# EasyEDA schematic SCH_minifinal_2022-12-07.json
TITLE: 2 Digit bcd adder/7 Segment Display; REV: 13.0; Date: 2022-12-01; Sheet: 1/1; Company: Your Company
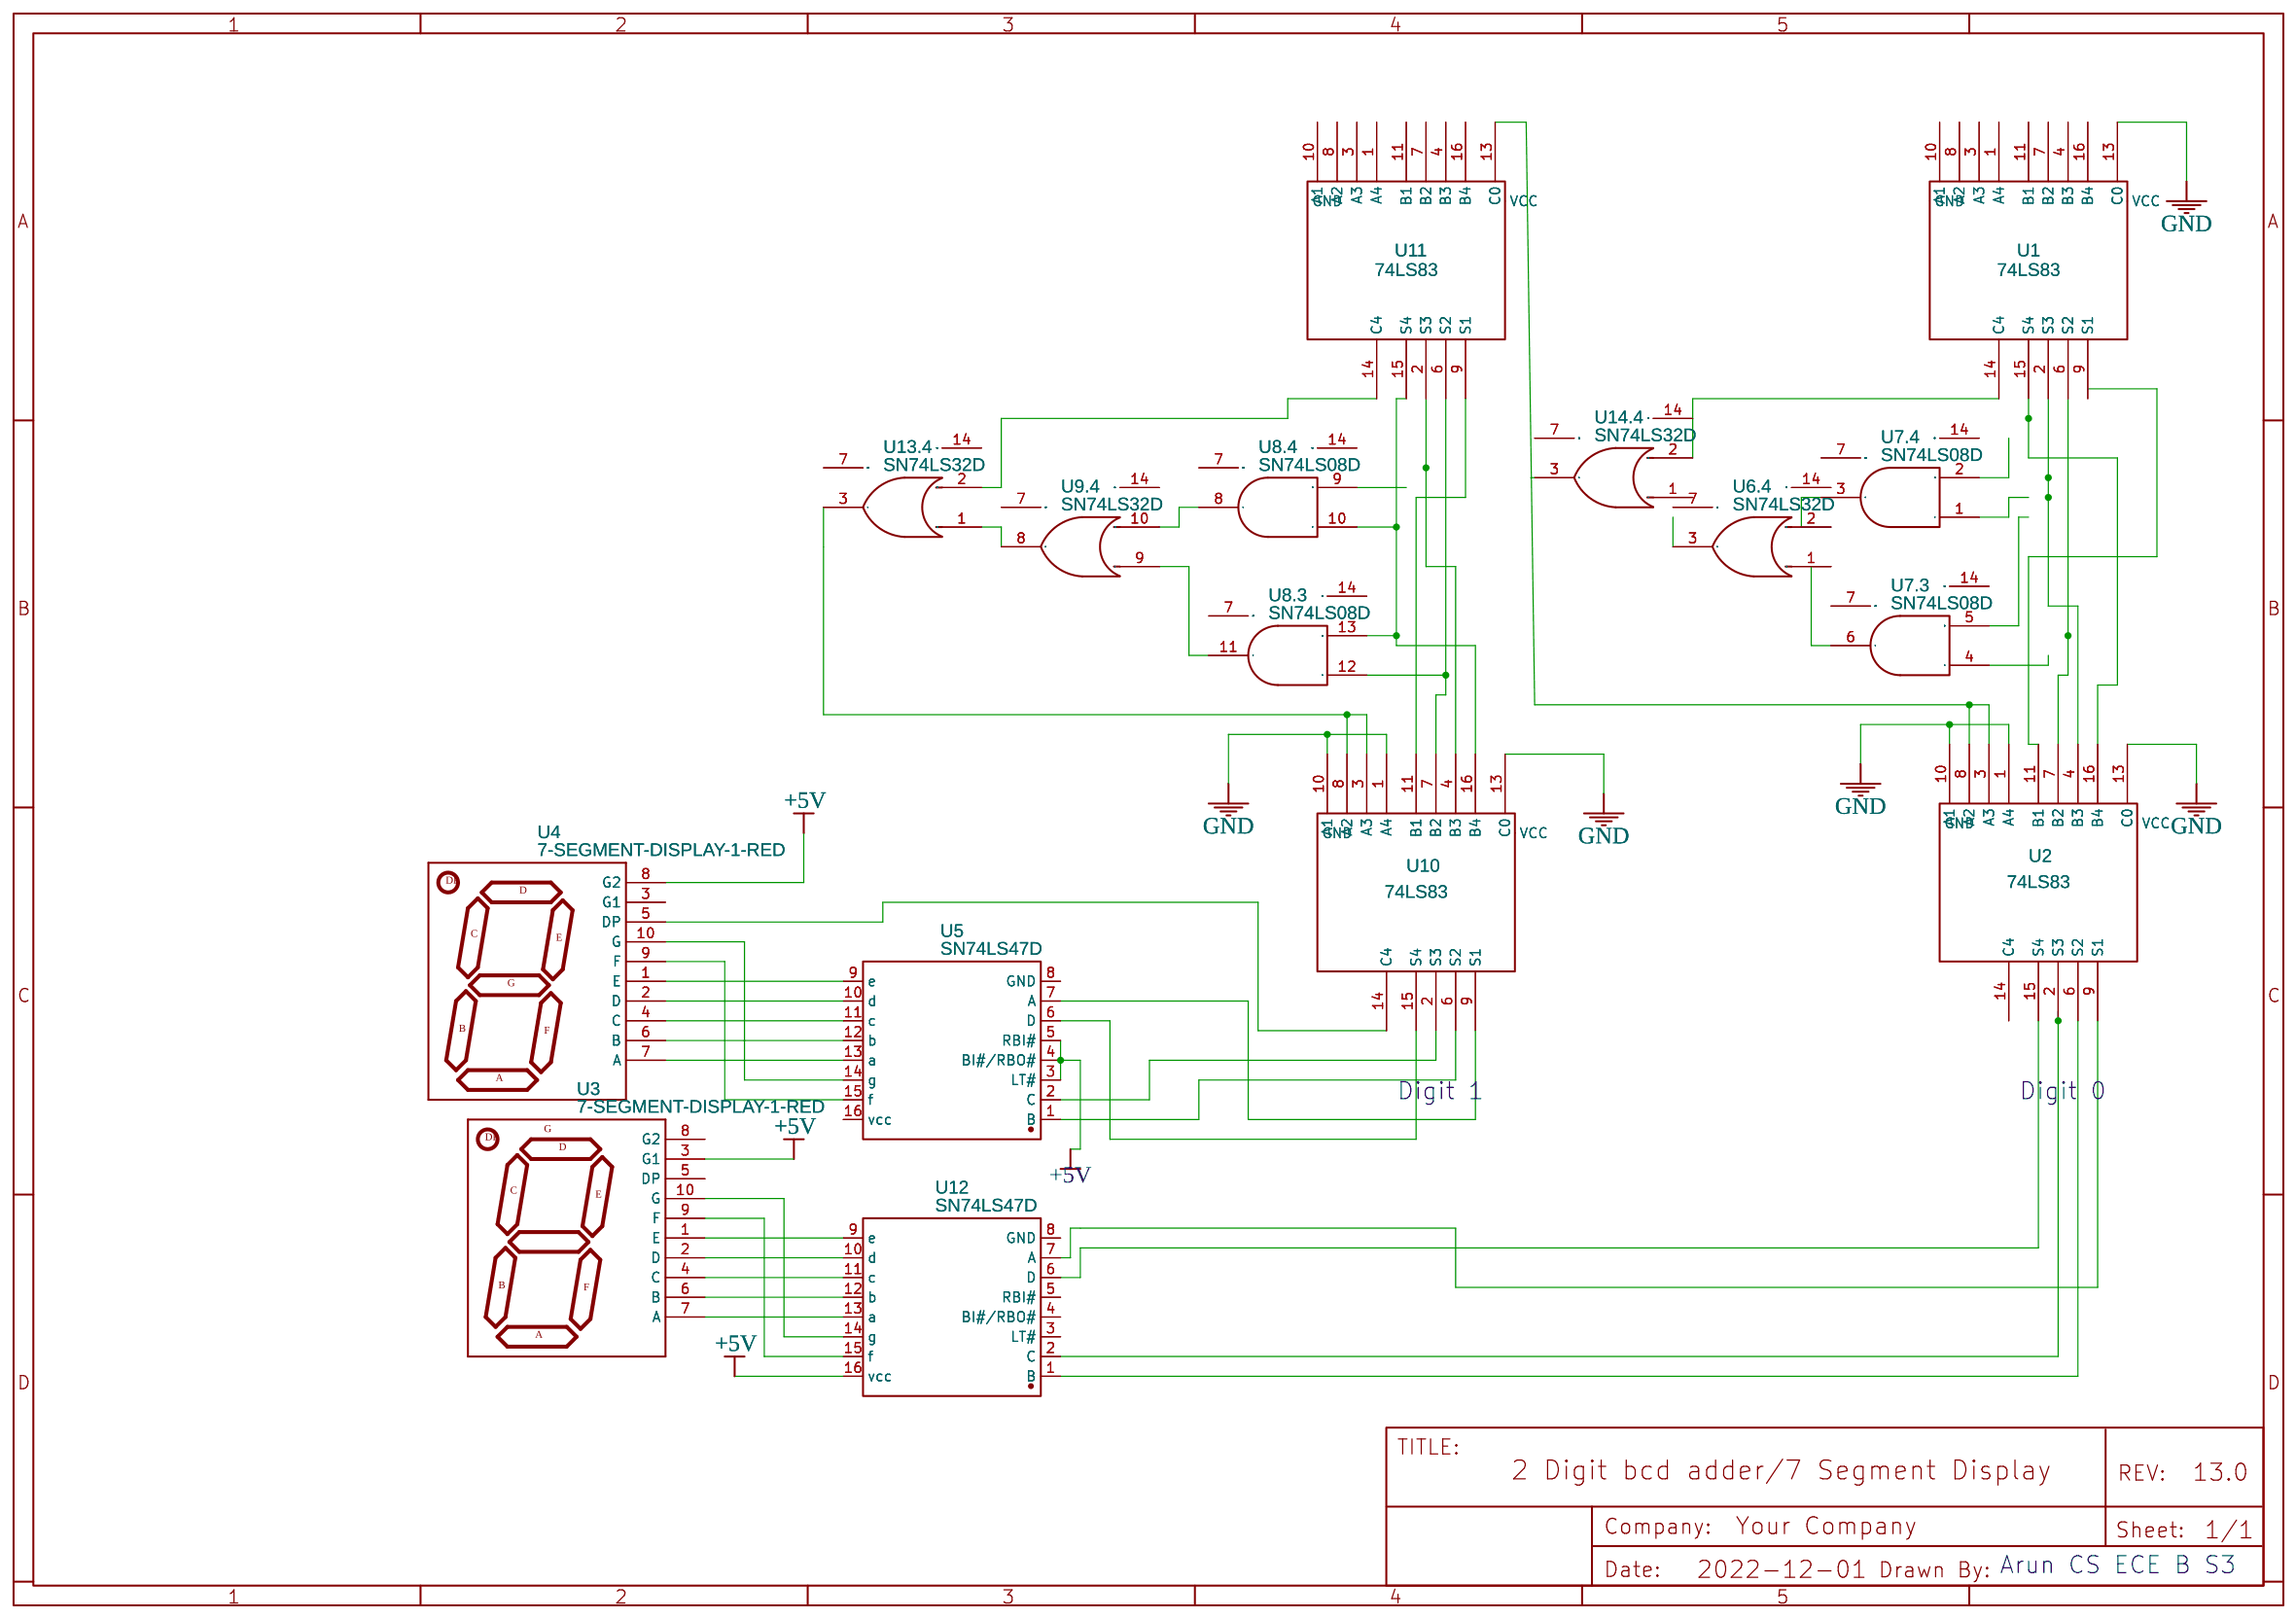
[diagram p0: schematic sheet]

## Parts
U1  74LS83
U2  74LS83
U3  7-SEGMENT-DISPLAY-1-RED  [7-SEGMENT-1PTH-EZ]
U4  7-SEGMENT-DISPLAY-1-RED  [7-SEGMENT-1PTH-EZ]
U5  SN74LS47D  [SOIC-16_L9.9-W3.9-P1.27-LS6.0-BL]
U6  SN74LS32D  [SOIC14N]  (section 4)
U7  SN74LS08D  [SOIC14N]  (sections 3,4)
U8  SN74LS08D  [SOIC14N]  (sections 3,4)
U9  SN74LS32D  [SOIC14N]  (section 4)
U10  74LS83
U11  74LS83
U12  SN74LS47D  [SOIC-16_L9.9-W3.9-P1.27-LS6.0-BL]
U13  SN74LS32D  [SOIC14N]  (section 4)
U14  SN74LS32D  [SOIC14N]  (section 4)

## Library data of the parts
U1 U2 U10 U11 = 74LS83: Contributor: KiCAD; license: https://www.gnu.org/licenses/lgpl-2.1.html
U3 U4 = 7-SEGMENT-DISPLAY-1-RED: Contributor: SparkFun
U5 U12 = SN74LS47D: Supplier: LCSC; Supplier Part: C1524098; Manufacturer: TI(德州仪器); Contributor: LCSC; JLCPCB Part Class: Extended Part
U6 U9 U13 U14 = SN74LS32D: Quad 2-Input OR Gate; subpart_no: 2
U7 U8 = SN74LS08D: Quad 2-Input AND Gate; subpart_no: 4

## Nets
+5V: U3.3(G1) U4.8(G2) U5.3(LT#) U5.4(BI#/RBO#) U5.5(RBI#) U12.16(vcc)
GND: U1.13(C0) U2.1(A4) U2.10(A1) U2.13(C0) U10.1(A4) U10.10(A1) U10.13(C0)
Net-(U1-2): U1.2(S3) U2.4(B3)
Net-(U1-6): U1.6(S2) U2.7(B2)
Net-(U1-14): U1.14(C4) U14.2(B)
Net-(U1-15): U1.15(S4) U2.16(B4)
Net-(U2-2): U2.2(S3) U12.2(C)
Net-(U2-3): U2.3(A3) U2.8(A2) U11.13(C0)
Net-(U2-6): U2.6(S2) U12.1(B)
Net-(U2-9): U2.9(S1) U12.7(A)
Net-(U2-15): U2.15(S4) U12.6(D)
Net-(U3-1): U3.1(E) U12.9(e)
Net-(U3-2): U3.2(D) U12.10(d)
Net-(U3-4): U3.4(C) U12.11(c)
Net-(U3-6): U3.6(B) U12.12(b)
Net-(U3-7): U3.7(A) U12.13(a)
Net-(U3-9): U3.9(F) U12.15(f)
Net-(U3-10): U3.10(G) U12.14(g)
Net-(U4-1): U4.1(E) U5.9(e)
Net-(U4-2): U4.2(D) U5.10(d)
Net-(U4-4): U4.4(C) U5.11(c)
Net-(U4-5): U4.5(DP) U10.14(C4)
Net-(U4-6): U4.6(B) U5.12(b)
Net-(U4-7): U4.7(A) U5.13(a)
Net-(U4-9): U4.9(F) U5.15(f)
Net-(U4-10): U4.10(G) U5.14(g)
Net-(U5-1): U5.1(B) U10.6(S2)
Net-(U5-2): U5.2(C) U10.2(S3)
Net-(U5-6): U5.6(D) U10.15(S4)
Net-(U5-7): U5.7(A) U10.9(S1)
Net-(U6.4-1): U6.1(A) U7.6(Y)
Net-(U6.4-2): U6.2(B) U7.3(Y)
Net-(U8.3-11): U8.11(Y) U9.9(A)
Net-(U8.3-12): U8.12(A) U10.7(B2) U11.6(S2)
Net-(U8.3-13): U8.10(A) U8.13(B) U10.16(B4) U11.15(S4)
Net-(U8.4-8): U8.8(Y) U9.10(B)
Net-(U9.4-8): U9.8(Y) U13.1(A)
Net-(U10-3): U10.3(A3) U10.8(A2) U13.3(Y)
Net-(U10-4): U10.4(B3) U11.2(S3)
Net-(U10-11): U10.11(B1) U11.9(S1)
Net-(U11-14): U11.14(C4) U13.2(B)

Not connected (* = marked no-connect by the designer): U1 1(A4) 3(A3) 4(B3) 5(VCC) 7(B2) 8(A2) 9(S1) 10(A1) 11(B1) 12(GND) 16(B4); U2 5(VCC) 11(B1) 12(GND) 14(C4); U3 5(DP) 8(G2); U4 3(G1); U5 8(GND) 16(vcc); U6 3(Y) 7(GND) 14(VCC); U7 1(A) 2(B) 4(A) 5(B) 7(GND) 14(VCC); U8 7(GND) 9(B) 14(VCC); U9 7(GND) 14(VCC); U10 5(VCC) 12(GND); U11 1(A4) 3(A3) 4(B3) 5(VCC) 7(B2) 8(A2) 10(A1) 11(B1) 12(GND) 16(B4); U12 3(LT#) 4(BI#/RBO#) 5(RBI#) 8(GND); U13 7(GND) 14(VCC); U14 1(A) 3(Y) 7(GND) 14(VCC)

## Notes on the sheet
- Digit 1
- Digit 0
- Arun CS ECE B S3
